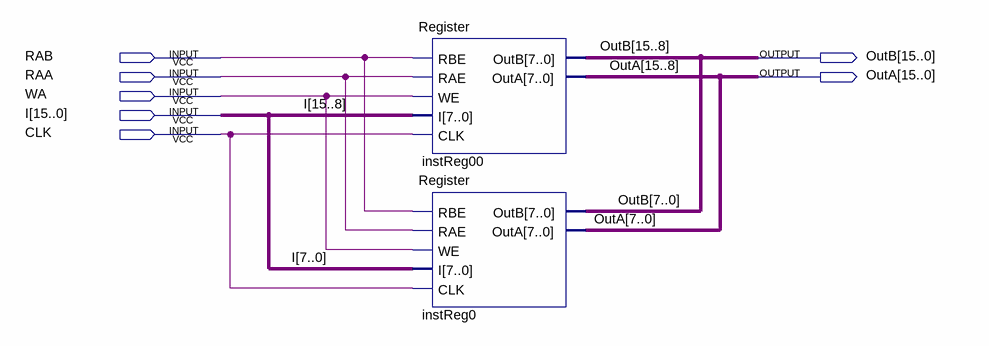
[diagram p0: schematic sheet]
// Quartus schematic 1Register16bit.bdf as structural Verilog: 2 symbols, 7 pins
module \1Register16bit  (
  input  RAB,
  input  RAA,
  input  WA,
  input  [15:0] I,
  input  CLK,
  output [15:0] OutB,
  output [15:0] OutA
);

  Register instReg00 (.RBE(RAB), .RAE(RAA), .WE(WA), .I(I[15:8]), .CLK(CLK), .OutB(OutB[15:8]), .OutA(OutA[15:8]));
  Register instReg0 (.RBE(RAB), .RAE(RAA), .WE(WA), .I(I[7:0]), .CLK(CLK), .OutB(OutB[7:0]), .OutA(OutA[7:0]));
endmodule
